# Altium schematic sheet proj_patrusheva_control_board_2.SchDoc: =title_line_1 + title_line_2
size 840 x 594 mm; SheetNumber: n
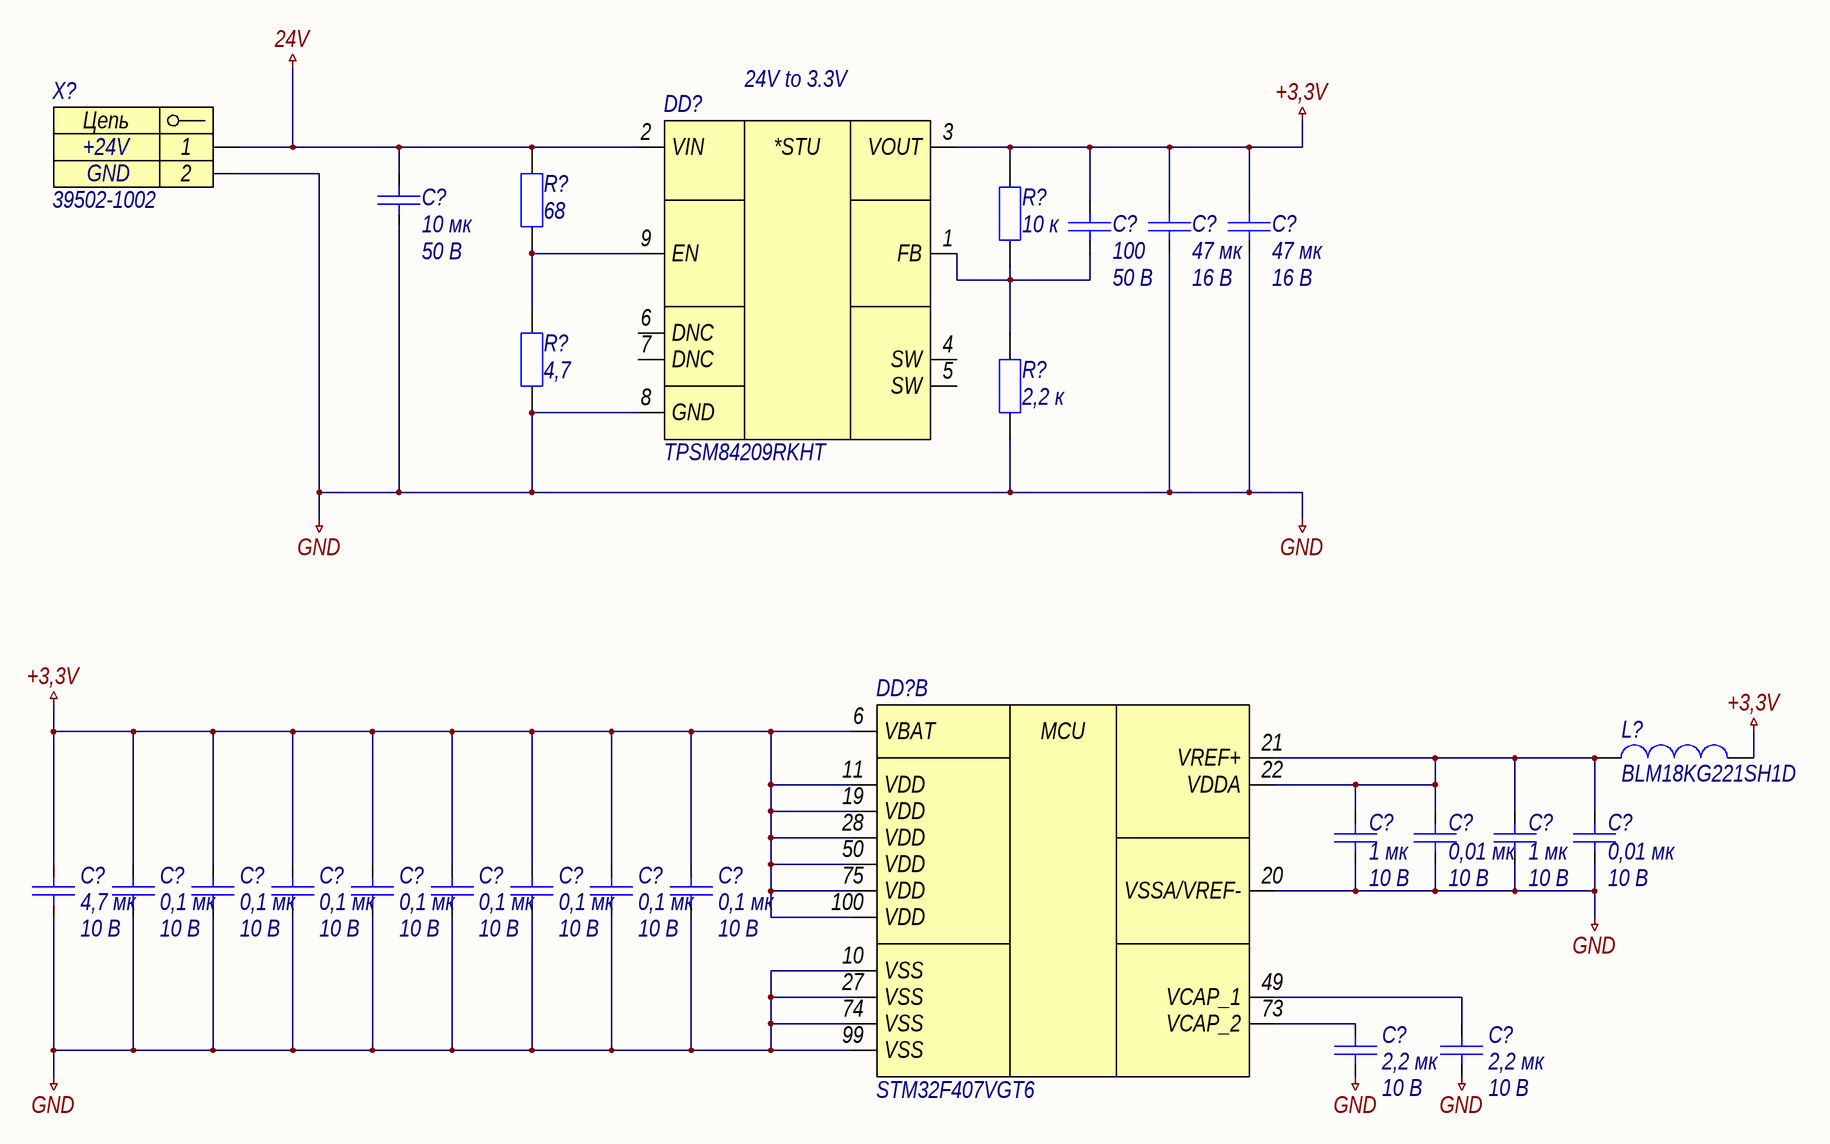
[diagram p0: proj_patrusheva_control_board_2.SchDoc]

## Parts
(Parts that share a designator on the sheet are numbered #1, #2 ... from top to bottom, then left to right.)
C?#1  10 мк  Напряжение: 50 В  [C0805]
C?#2  100  Напряжение: 50 В  [C0603]
C?#3  47 мк  Напряжение: 16 В  [C1206]
C?#4  47 мк  Напряжение: 16 В  [C1206]
C?#5  1 мк  Напряжение: 10 В  [C0603]
C?#6  0,01 мк  Напряжение: 10 В  [C0603]
C?#7  1 мк  Напряжение: 10 В  [C0603]
C?#8  0,01 мк  Напряжение: 10 В  [C0603]
C?#9  4,7 мк  Напряжение: 10 В  [C0805]
C?#10  0,1 мк  Напряжение: 10 В  [C0603]
C?#11  0,1 мк  Напряжение: 10 В  [C0603]
C?#12  0,1 мк  Напряжение: 10 В  [C0603]
C?#13  0,1 мк  Напряжение: 10 В  [C0603]
C?#14  0,1 мк  Напряжение: 10 В  [C0603]
C?#15  0,1 мк  Напряжение: 10 В  [C0603]
C?#16  0,1 мк  Напряжение: 10 В  [C0603]
C?#17  0,1 мк  Напряжение: 10 В  [C0603]
C?#18  2,2 мк  Напряжение: 10 В  [C0603]
C?#19  2,2 мк  Напряжение: 10 В  [C0603]
DD?#1  TPSM84209RKHT  [QFN-FCMOD-9-P65-450X400X210]
DD?#2  STM32F407VGT6  [LQFP-100-P50-1400X1400X160-L60X22]  (part B of 2)
L?  BLM18KG221SH1D  [BLM-2-0603]
R?#1  68  [R0603]
R?#2  10 к  [R0603]
R?#3  4,7  [R0603]
R?#4  2,2 к  [R0603]
X?  39502-1002  [39502-1002]

## Nets
24V: C?#1.1 DD?#1.2(VIN) R?#1.2 X?.1
+3,3V: C?#2.1 C?#3.1 C?#4.1 C?#9.1 C?#10.1 C?#11.1 C?#12.1 C?#13.1 C?#14.1 C?#15.1 C?#16.1 C?#17.1 DD?#1.3(VOUT) DD?#2.6(VBAT) DD?#2.11(VDD) DD?#2.19(VDD) DD?#2.28(VDD) DD?#2.50(VDD) DD?#2.75(VDD) DD?#2.100(VDD) L?.2 R?#2.2
GND: C?#1.2 C?#3.2 C?#4.2 C?#5.2 C?#6.2 C?#7.2 C?#8.2 C?#9.2 C?#10.2 C?#11.2 C?#12.2 C?#13.2 C?#14.2 C?#15.2 C?#16.2 C?#17.2 C?#18.2 C?#19.2 DD?#1.8(GND) DD?#2.10(VSS) DD?#2.20(VSSA/VREF-) DD?#2.27(VSS) DD?#2.74(VSS) DD?#2.99(VSS) R?#3.1 R?#4.1 X?.2
NetC?#2_2: C?#2.2 DD?#1.1(FB) R?#2.1 R?#4.2
NetC?#5_1: C?#5.1 C?#6.1 C?#7.1 C?#8.1 DD?#2.21(VREF+) DD?#2.22(VDDA) L?.1
NetC?#18_1: C?#18.1 DD?#2.73(VCAP_2)
NetC?#19_1: C?#19.1 DD?#2.49(VCAP_1)
NetDD?#1_9: DD?#1.9(EN) R?#1.1 R?#3.2

Not connected (* = marked no-connect by the designer): DD?#1 4(SW) 5(SW) 6(DNC) 7(DNC)

## Notes on the sheet
- (near DD?#1) 24V to 3.3V
- Подп. и дата
- Инв. № дубл.
- Взам. инв. №
- Инв. № подл.
- Лист
- Изм.
- № докум.
- Подп.
- Дата
- Копировал
- Формат
- А1
- (in symbol dd0001, part B) MCU
- (in symbol dd0020) *STU
- (in symbol x0050) Цепь

## Library data of the parts
C?#1 = c0151: =Описание; ID: c0151; Фамилия: Паньков; Описание: Конденсатор керамический чип 0805 10 мкФ 50 В ±10 %; Наименование: CC0805KKX5R9BB106; Производитель: YAGEO Corp.; Отклонение: ±10 %; Рабочие температуры: от –55 °С до +85 °С; Температурный коэффициент емкости: X5R; Корпус: 0805; Номинал: 10 мк; Номинальное напряжение: 50 В; HelpURL: https://www.yageo.com/upload/media/product/productsearch/datasheet/mlcc/UPY-GPHC_X5R_4V-to-50V_26.pdf
C?#2 = c0027: =Описание; ID: c0027; Фамилия: Паньков; Описание: Конденсатор керамический чип 0603 100 пФ 50 В ±1 %; Наименование: CC0603FRNPO9BN101; Производитель: YAGEO Corp.; Отклонение: ±1 %; Рабочие температуры: от –55 °С до +125 °С; Температурный коэффициент емкости: C0G; Корпус: 0603; Номинал: 100; Номинальное напряжение: 50 В; HelpURL: https://www.yageo.com/upload/media/product/productsearch/datasheet/mlcc/UPY-GP_NP0_16V-to-50V_18.pdf
C?#3 C?#4 = c0170: =Описание; ID: c0170; Фамилия: Паньков; Описание: Конденсатор керамический чип 1206 47 мкФ 16 В ±20 %; Наименование: CC1206MKX5R7BB476; Производитель: YAGEO Corp.; Отклонение: ±20 %; Рабочие температуры: от –55 °С до +85 °С; Температурный коэффициент емкости: X5R; Корпус: 1206; Номинал: 47 мк; Номинальное напряжение: 16 В; HelpURL: https://www.yageo.com/upload/media/product/productsearch/datasheet/mlcc/UPY-GPHC_X5R_4V-to-50V_26.pdf
C?#5 C?#7 = c0086: =Описание; ID: c0086; Фамилия: Паньков; Описание: Конденсатор керамический чип 0603 1 мкФ 10 В ±10 %; Наименование: CC0603KRX7R6BB105; Производитель: YAGEO Corp.; Отклонение: ±10 %; Рабочие температуры: от –55 °С до +125 °С; Температурный коэффициент емкости: X7R; Корпус: 0603; Номинал: 1 мк; Номинальное напряжение: 10 В; HelpURL: https://www.yageo.com/upload/media/product/productsearch/datasheet/mlcc/UPY-GPHC_X7R_6.3V-to-50V_20.pdf
C?#6 C?#8 = c0033: =Описание; ID: c0033; Фамилия: Паньков; Описание: Конденсатор керамический чип 0603 10 нФ 10 В ±10 %; Наименование: CC0603KRX7R6BB103; Производитель: YAGEO Corp.; Отклонение: ±10 %; Рабочие температуры: от –55 °С до +125 °С; Температурный коэффициент емкости: X7R; Корпус: 0603; Номинал: 0,01 мк; Номинальное напряжение: 10 В; HelpURL: https://www.yageo.com/upload/media/product/productsearch/datasheet/mlcc/UPY-GPHC_X7R_6.3V-to-50V_20.pdf
C?#9 = c0108: =Описание; ID: c0108; Фамилия: Паньков; Описание: Конденсатор керамический чип 0805 4,7 мкФ 10 В ±10 %; Наименование: CC0805KKX7R6BB475; Производитель: YAGEO Corp.; Отклонение: ±10 %; Рабочие температуры: от –55 °С до +125 °С; Температурный коэффициент емкости: X7R; Корпус: 0805; Номинал: 4,7 мк; Номинальное напряжение: 10 В; HelpURL: https://www.yageo.com/upload/media/product/productsearch/datasheet/mlcc/UPY-GPHC_X7R_6.3V-to-50V_20.pdf
C?#10-C?#17 = c0054: =Описание; ID: c0054; Фамилия: Паньков; Описание: Конденсатор керамический чип 0603 100 нФ 10 В ±10 %; Наименование: CC0603KRX7R6BB104; Производитель: YAGEO Corp.; Отклонение: ±10 %; Рабочие температуры: от –55 °С до +125 °С; Температурный коэффициент емкости: X7R; Корпус: 0603; Номинал: 0,1 мк; Номинальное напряжение: 10 В; HelpURL: https://www.yageo.com/upload/media/product/productsearch/datasheet/mlcc/UPY-GPHC_X7R_6.3V-to-50V_20.pdf
C?#18 C?#19 = c0097: =Описание; ID: c0097; Фамилия: Чернов; Описание: Конденсатор керамический чип 0603 2,2 мкФ 10 В ±10 %; Наименование: CC0603KRX7R6BB225; Производитель: YAGEO Corp.; Отклонение: ±10 %; Рабочие температуры: от –55 °С до +125 °С; Температурный коэффициент емкости: X7R; Корпус: 0603; Номинал: 2,2 мк; Номинальное напряжение: 10 В; HelpURL: https://www.yageo.com/upload/media/product/productsearch/datasheet/mlcc/UPY-GPHC_X7R_6.3V-to-50V_20.pdf
DD?#1 = dd0020: =Описание; ID: dd0020; Фамилия: Паньков; Описание: Понижающий преобразователь напряжения 4,5…28 В / 1,2…6,0 В и 2,5 А; Производитель: Texas Instruments Inc.; Входное напряжение: от 4,5 В до 28 В; Выходное напряжение: от 1,2 до 6,0 В; Коммутируемый ток: до 2,5 А; Частота переключения: от 578 кГц до 923 кГц; Рабочие температуры: от –40 °С до +85 °С; Корпус: QFN-FCMOD-16; Наименование: TPSM84209RKHT; HelpURL: https://www.ti.com/product/TPSM84209
DD?#2 = dd0001: =Описание; ID: dd0001; Фамилия: Паньков; Описание: ARM Cortex-M4 32-разрядный микроконтроллер 168 МГц 1 Мбайт FLASH-памяти; Производитель: STMicroelectronics; Рабочее напряжение: от 1,8 В до 3,6 В; Максимальная тактовая частота: 168 МГц; Поддерживаемые интерфейсы: CAN, I2C, SDIO, I2S/SPI, UART/USART, USB; Рабочие температуры: от –40 °С до +85 °С; Корпус: LQFP-100; Наименование: STM32F407VGT6; HelpURL: https://www.st.com/en/microcontrollers-microprocessors/stm32f407vg.html
L? = l0001: =Описание; ID: l0001; Фамилия: Ларионов; Описание: Ферритовая бусина 220 Ом ±25 %; Производитель: Murata Manufacturing Co., Ltd.; Сопротивление, 100 МГц: 220 Ом; Отклонение, 100 МГц: ±25 %; Сопротивление при постоянном токе: 0,05 Ом; Рабочие температуры: от –55 °С до +125 °С; Корпус: 0603; Наименование: BLM18KG221SH1D; HelpURL: https://www.murata.com/en-global/products/productdetail?partno=BLM18KG221SH1%23
R?#1 = r0047: =Описание; ID: r0047; Фамилия: Паньков; Описание: Резистор чип 0603 68 Ом ±1 % 0,1 Вт; Наименование: RC0603FR-0768RL; Производитель: YAGEO Corp.; Отклонение: ±1 %; Номинальное напряжение: 75 В; Номинальный ток: 1 А; Рабочие температуры: от –55 °С до +155 °С; Корпус: 0603; Примечание: Ряд E24; Номинал: 68; HelpURL: https://www.yageo.com/upload/media/product/productsearch/datasheet/rchip/PYu-RC_Group_51_RoHS_L_11.pdf
R?#2 = r0105: =Описание; ID: r0105; Фамилия: Самарин; Описание: Резистор чип 0603 10 кОм ±1 % 0,1 Вт; Наименование: RC0603FR-0710KL; Производитель: YAGEO Corp.; Отклонение: ±1 %; Номинальное напряжение: 75 В; Номинальный ток: 1 А; Рабочие температуры: от –55 °С до +155 °С; Корпус: 0603; Примечание: Ряд E24; Номинал: 10 к; HelpURL: https://www.yageo.com/upload/media/product/productsearch/datasheet/rchip/PYu-RC_Group_51_RoHS_L_11.pdf
R?#3 = r0019: =Описание; ID: r0019; Фамилия: Паньков; Описание: Резистор чип 0603 4,7 Ом ±1 % 0,1 Вт; Наименование: RC0603FR-074R7L; Производитель: YAGEO Corp.; Отклонение: ±1 %; Номинальное напряжение: 75 В; Номинальный ток: 1 А; Рабочие температуры: от –55 °С до +155 °С; Корпус: 0603; Примечание: Ряд E24; Номинал: 4,7; HelpURL: https://www.yageo.com/upload/media/product/productsearch/datasheet/rchip/PYu-RC_Group_51_RoHS_L_11.pdf
R?#4 = r0085: =Описание; ID: r0085; Фамилия: Паньков; Описание: Резистор чип 0603 2,2 кОм ±1 % 0,1 Вт; Наименование: RC0603FR-072K2L; Производитель: YAGEO Corp.; Отклонение: ±1 %; Номинальное напряжение: 75 В; Номинальный ток: 1 А; Рабочие температуры: от –55 °С до +155 °С; Корпус: 0603; Примечание: Ряд E24; Номинал: 2,2 к; HelpURL: https://www.yageo.com/upload/media/product/productsearch/datasheet/rchip/PYu-RC_Group_51_RoHS_L_11.pdf
X? = x0050: =Описание; Contact_1: +24V; Contact_2: GND; ID: x0050; Фамилия: Шкабара; Описание: Terminal Block 2 pin 3,5 мм; Производитель: Molex; Наименование: 39502-1002; HelpURL: https://www.molex.com/molex/products/part-detail/terminal_blocks/0395021002